# EasyEDA Pro project ProPrj_MEMSdesign_2025-04-10.epro, board PCB2_1
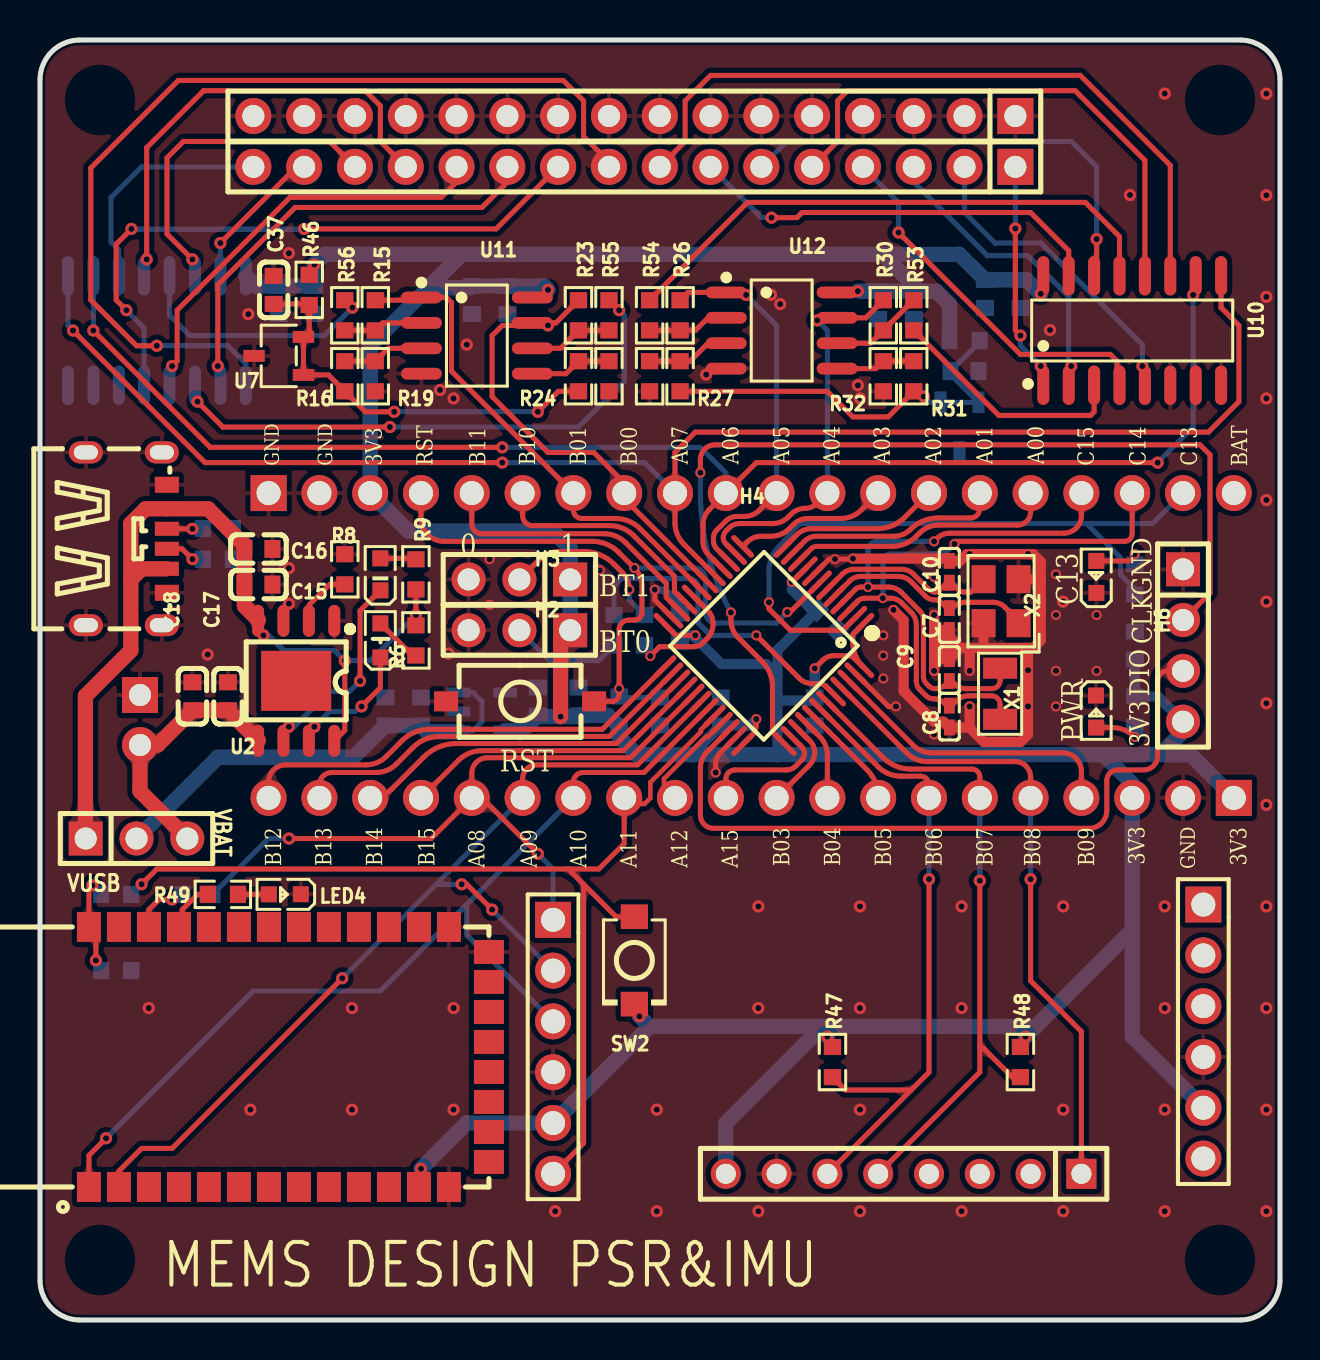
[diagram p4: board, top side]
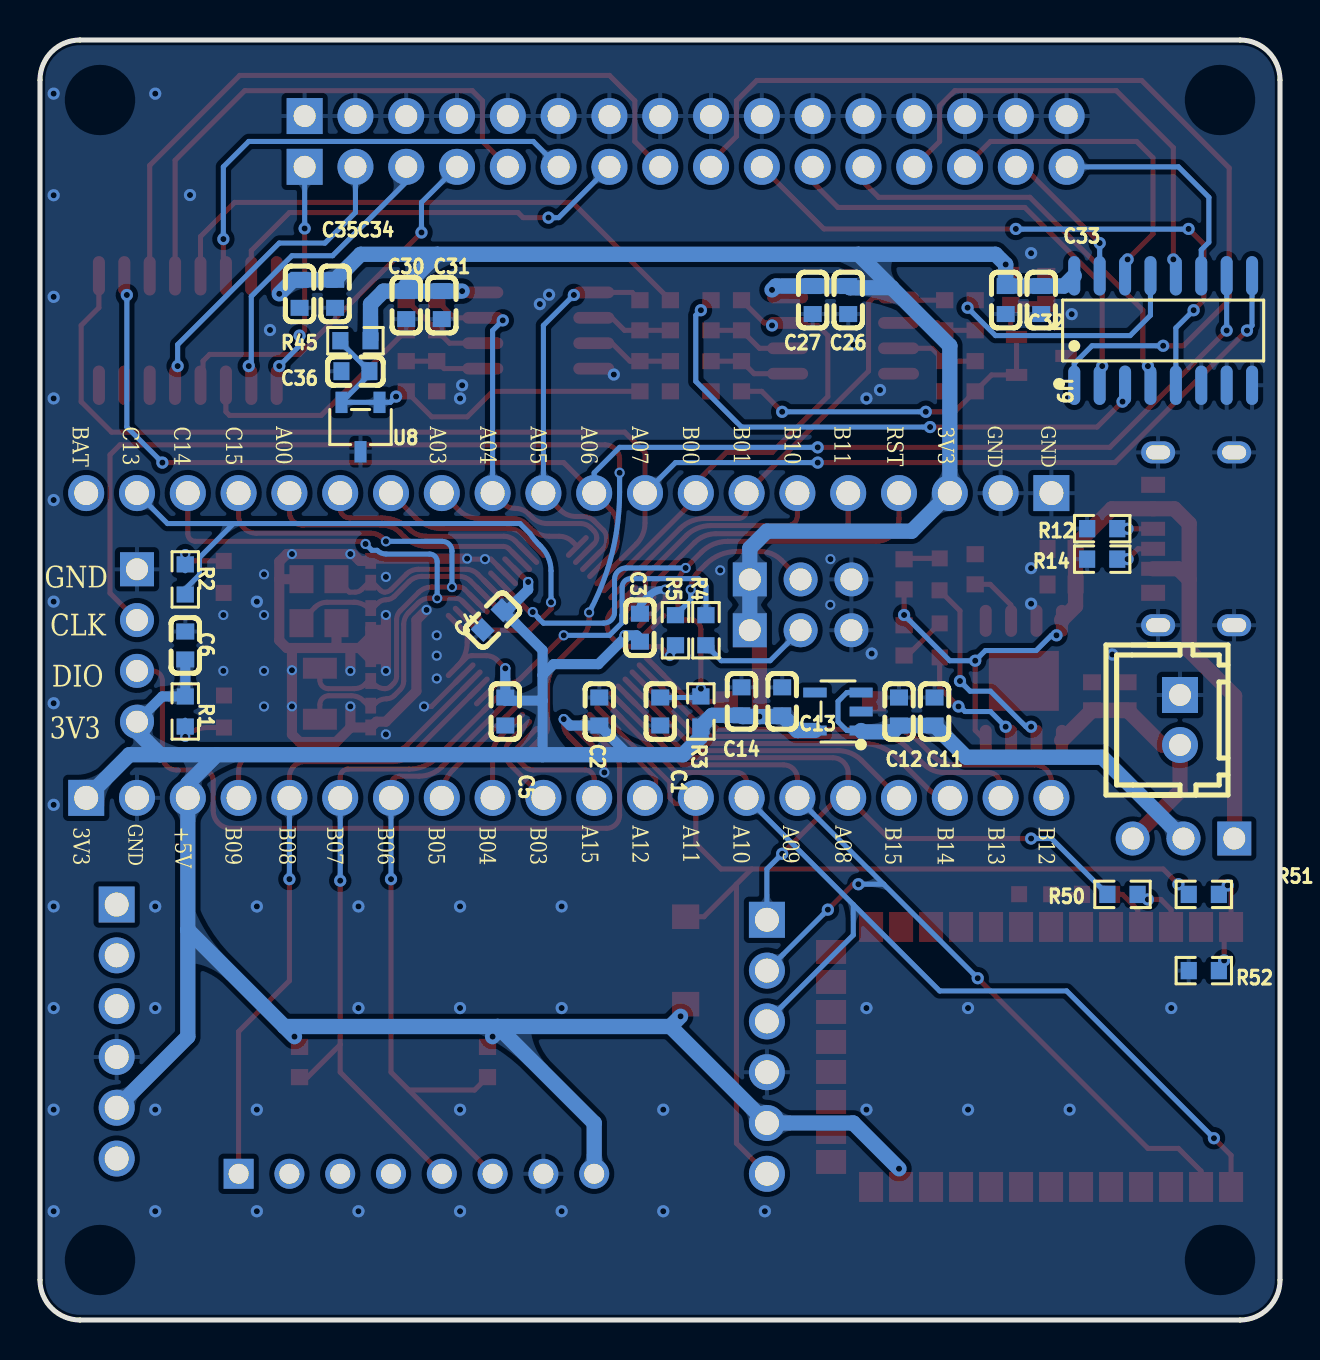
[diagram p5: board, bottom side, seen from below]

Outline 62 x 64 mm; copper layers: Top Layer, Bottom Layer. Coordinates in mm from the lower left corner of the outline.
Outline path: 0,62 arc(0.59,63.41) 2,64 60,64 arc(61.41,63.41) 62,62 62,2 arc(61.41,0.59) 60,0 2,0 arc(0.59,0.59) 0,2 0,62
Stack: Top Layer 0.035mm / Dielectric1 1.51mm FR4 er 4.5 / Bottom Layer 0.035mm

## Design rules (mm)
template: JLCPCB Capability(Two Layers Board)
spacing copperThickness1oz (default): track to track 0.102, other pairs 0.152 to 0.3
spacing copperThickness2oz: track to track 0.203, other pairs 0.152 to 0.3
track width copperThickness1oz (default): min 0.127, default 0.254, max 2.54
track width copperThickness2oz: min 0.203, default 0.254, max 2.54
differential pair differentialPair (default): width min 0.127, default 0.254, max 2.54; gap min 0.152, default 0.152
via viaSize (default): diameter min 0.5, default 0.61, max 10; hole min 0.3, default 0.305, max 6.3

## Placement (name value [footprint] x y rotation side)
C1  100nF  [C0603]  30.99 30.42 90 bottom
C2  100nF  [C0603]  34.04 30.42 270 bottom
C3  100nF  [C0603]  32 34.61 270 bottom
C4  100nF  [C0603]  39.37 35 135 bottom
C5  100nF  [C0603]  38.74 30.42 90 bottom
C6  100nF  [C0603]  54.74 33.73 270 bottom
C7  12pF  [C0402]  45.47 35.05 270 top
C8  12pF  [C0402]  45.47 30.17 90 top
C9  12pF  [C0402]  45.47 32.5 270 top
C10  12pF  [C0402]  45.47 37.41 270 top
C11  1uF  [C0603]  17.27 30.42 270 bottom
C12  100nF  [C0603]  19.05 30.42 270 bottom
C13  100nF  [C0603]  24.89 30.93 270 bottom
C14  1uF  [C0603]  26.92 30.93 270 bottom
C15  100n  [C0603]  10.92 36.77 180 top
C16  10u  [C0603]  10.92 38.55 180 top
C17  10u  [C0603]  9.4 31.19 270 top
C18  100n  [C0603]  7.62 31.19 270 top
C26  10u  [C0603]  21.59 51 270 bottom
C27  100nF  [C0603]  23.37 51 270 bottom
C30  10u  [C0603]  43.69 50.74 270 bottom
C31  100nF  [C0603]  41.91 50.74 270 bottom
C32  10u  [C0603]  13.72 51 270 bottom
C33  100nF  [C0603]  11.94 51 270 bottom
C34  10u  [C0603]  47.24 51.31 270 bottom
C35  100nF  [C0603]  49.02 51.31 270 bottom
C36  100nF  [C0603]  46.23 47.44 180 bottom
C37  100nF  [C0603]  11.68 51.51 270 top
CN1  ZX-XH2.54-2PZZ  [CONN-TH_2P-P2.50_HX25003-2A]  5 30 270 bottom
H1  PZ254V-11-08P  [HDR-TH_8P-P2.54-V-M]  43.18 7.31 180 top
H2  -  [HDR-TH_3P-P2.54-V-M]  23.97 34.49 180 top
H3  -  [HDR-TH_3P-P2.54-V-M]  23.97 37.03 180 top
H4  -  [HDR-TH_20P-P2.54-V-M-1]  35.56 41.35 0 top
H5  -  [HDR-TH_20P-P2.54-V-M-1]  35.56 26.11 180 top
H6  -  [HDR-TH_4P-P2.54-V-M]  57.15 33.73 270 top
H8  PZ254V-11-03P  [HDR-TH_3P-P2.54-V-M]  4.83 24.07 0 top
H10  -  [HDR-TH_6P-P2.54-V-M-1]  25.65 13.66 270 top
H11  HC05  [BULETM-SMD_HC-05]  12.45 13.15 90 top
H12  -  [HDR-TH_6P-P2.54-V-M-1]  58.17 14.42 270 top
H13  HC-PZ254-11.5L-1x16PZ  [HDR-TH_16P-P2.54-V-M]  29.72 60.2 180 top
H14  HC-PZ254-11.5L-1x16PZ  [HDR-TH_16P-P2.54-V-M]  29.72 57.66 180 top
LDO1  ME6211C33M5G-N  [SOT-23-5_L3.0-W1.7-P0.95-LS2.8-BL]  22.1 30.42 90 bottom
LED1  -  [LED_0603]  52.81 30.37 270 top
LED2  -  [LED_0603]  52.81 37.21 90 top
LED3  SZYY0603R  [LED0603-R-RD]  17.02 33.98 90 top
LED4  -  [LED_0603]  12.19 21.28 180 top
R1  1kΩ  [R0603]  54.74 30.42 90 bottom
R2  1kΩ  [R0603]  54.74 37.03 270 bottom
R3  10kΩ  [R0603]  28.96 30.42 270 bottom
R4  10kΩ  [R0603]  28.7 34.49 90 bottom
R5  10kΩ  [R0603]  30.23 34.49 90 bottom
R6  2k  [R0603]  18.8 33.98 270 top
R8  1.2k  [R0603]  15.24 37.54 270 top
R9  10k  [R0603]  18.8 37.28 90 top
R12  5.1kΩ  [R0603]  8.89 39.57 0 bottom
R14  5.1kΩ  [R0603]  8.89 38.04 0 bottom
R15  15k  [R0603]  16.76 50.24 90 top
R16  240k  [R0603]  15.24 47.19 90 top
R19  10K  [R0603]  16.76 47.19 90 top
R23  15k  [R0603]  26.92 50.24 90 top
R24  240k  [R0603]  26.92 47.19 90 top
R25  10K  [R0603]  28.45 47.19 90 top
R26  15k  [R0603]  32 50.24 90 top
R27  240k  [R0603]  32 47.19 90 top
R28  10K  [R0603]  30.48 47.19 90 top
R30  15k  [R0603]  42.16 50.24 90 top
R31  240k  [R0603]  43.69 47.19 90 top
R32  10K  [R0603]  42.16 47.19 90 top
R45  1k  [R0603]  46.23 48.97 180 bottom
R46  1k  [R0603]  13.46 51.51 90 top
R47  4.7k  [R0603]  39.62 12.9 90 top
R48  4.7k  [R0603]  49.02 12.9 90 top
R49  1k  [R0603]  9.14 21.28 0 top
R50  10K  [R0603]  7.87 21.28 0 bottom
R51  10K  [R0603]  3.81 21.28 0 bottom
R52  10K  [R0603]  3.81 17.47 0 bottom
R53  0R  [R0603]  43.69 50.24 90 top
R54  0R  [R0603]  30.48 50.24 270 top
R55  0R  [R0603]  28.45 50.24 270 top
R56  0R  [R0603]  15.24 50.24 270 top
SW1  TS-1101-B-W  [KEY-SMD_2P-L6.0-W3.6-P7.4-LS8.0-L]  24 30.93 0 top
SW2  TS-1088-AR02016  [SW-SMD_L3.9-W3.0-P4.45]  29.72 17.98 270 top
U1  STM32F103C8T6  [LQFP-48_L7.0-W7.0-P0.50-LS9.0-BL]  36.19 33.73 135 top
U2  TP4056-MS  [SOP-8_L4.9-W3.9-P1.27-LS6.0-TL-EP]  12.81 31.96 270 top
U3  XL-1608PGC-06  [LED0603-RD_GREEN]  17.02 37.28 90 top
U7  TL431AIDBZR  [SOT-23-3_L2.9-W1.6-P1.90-LS2.8-BR]  11.94 48.2 0 top
U8  TL431AIDBZR  [SOT-23-3_L2.9-W1.6-P1.90-LS2.8-BR]  45.97 44.65 90 bottom
U9  CD4052BM96  [SOIC-16_L9.9-W3.9-P1.27-LS6.0-BL]  5.84 49.47 180 bottom
U10  CD4052BM96  [SOIC-16_L9.9-W3.9-P1.27-LS6.0-BL]  54.61 49.47 0 top
U11  SGM8552XS8G/TR  [SOIC-8_L4.9-W3.9-P1.27-LS6.0-BL]  21.84 49.22 270 top
U12  SGM8552XS8G/TR  [SOIC-8_L4.9-W3.9-P1.27-LS6.0-BL]  37.08 49.47 270 top
USB1  TYPE-C 6P(073)  [TYPE-C-SMD_TYPE-C-6P_5]  4.32 39.06 270 top
X1  32.768kHz  [OSC-SMD_L3.2-W1.5]  48.01 31.31 90 top
X2  8MHz  [CRYSTAL-SMD_4P-L3.2-W2.5-BL-1]  48.05 35.94 90 top

## Footprints (pads in the part's own frame, mm; a bottom-side part is the same pattern mirrored in y, then rotated)
BULETM-SMD_HC-05
  rect 1.5x1.2 smd: 1(-6.5,10) 2(-6.5,8.5) 3(-6.5,7) 4(-6.5,5.5) 5(-6.5,4) 6(-6.5,2.5) 7(-6.5,1) 8(-6.5,-0.5) 9(-6.5,-2) 10(-6.5,-3.5) 11(-6.5,-5) 12(-6.5,-6.5) 13(-6.5,-8) 22(6.5,-8) 23(6.5,-6.5) 24(6.5,-5) 25(6.5,-3.5) 26(6.5,-2) 27(6.5,-0.5) 28(6.5,1) 29(6.5,2.5) 30(6.5,4) 31(6.5,5.5) 32(6.5,7) 33(6.5,8.5) 34(6.5,10)
  rect 1.2x1.5 smd: 14(-5.25,-10) 15(-3.75,-10) 16(-2.25,-10) 17(-0.75,-10) 18(0.75,-10) 19(2.25,-10) 20(3.75,-10) 21(5.25,-10)
C0402
  rect 0.79x0.54 smd: 1(-0.545,0) 2(0.545,0)
C0603
  rect 0.8x0.9 smd: 1(-0.7,0) 2(0.7,0)
CONN-TH_2P-P2.50_HX25003-2A
  rect 1.8x1.8 hole 1.1: 1(-1.25,0)
  round 1.8 hole 1.1: 2(1.25,0)
CRYSTAL-SMD_4P-L3.2-W2.5-BL-1
  rect 1.4x1.2 smd: 1(-1.1,-0.875) 2(1.1,-0.875) 3(1.1,0.875) 4(-1.1,0.875)
HDR-TH_3P-P2.54-V-M
  rect 1.7x1.7 hole 1.1: 1(-2.54,0)
  round 1.7 hole 1.1: 2(0,0) 3(2.54,0)
HDR-TH_4P-P2.54-V-M
  rect 1.7x1.7 hole 1.1: 1(-3.81,0)
  round 1.7 hole 1.1: 2(-1.27,0) 3(1.27,0) 4(3.81,0)
HDR-TH_6P-P2.54-V-M-1
  rect 1.8x1.8 hole 1.2: 1(-6.35,0)
  round 1.8 hole 1.2: 2(-3.81,0) 3(-1.27,0) 4(1.27,0) 5(3.81,0) 6(6.35,0)
HDR-TH_8P-P2.54-V-M
  rect 1.5x1.5 hole 1: 1(-8.89,0)
  round 1.5 hole 1: 2(-6.35,0) 3(-3.81,0) 4(-1.27,0) 5(1.27,0) 6(3.81,0) 7(6.35,0) 8(8.89,0)
HDR-TH_16P-P2.54-V-M
  rect 1.8x1.8 hole 1.1: 1(-19.05,0)
  round 1.8 hole 1.1: 2(-16.51,0) 3(-13.97,0) 4(-11.43,0) 5(-8.89,0) 6(-6.35,0) 7(-3.81,0) 8(-1.27,0) 9(1.27,0) 10(3.81,0) 11(6.35,0) 12(8.89,0) 13(11.43,0) 14(13.97,0) 15(16.51,0) 16(19.05,0)
HDR-TH_20P-P2.54-V-M-1
  rect 1.8x1.8 hole 1.2: 1(-24.13,0)
  round 1.8 hole 1.2: 2(-21.59,0) 3(-19.05,0) 4(-16.51,0) 5(-13.97,0) 6(-11.43,0) 7(-8.89,0) 8(-6.35,0) 9(-3.81,0) 10(-1.27,0) 11(1.27,0) 12(3.81,0) 13(6.35,0) 14(8.89,0) 15(11.43,0) 16(13.97,0) 17(16.51,0) 18(19.05,0) 19(21.59,0) 20(24.13,0)
KEY-SMD_2P-L6.0-W3.6-P7.4-LS8.0-L
  rect 1.2x1 smd: 1(-3.7,0) 2(3.7,0)
LED0603-R-RD
  rect 0.8x0.8 smd: 1(0.851,0) 2(-0.851,0)
LED0603-RD_GREEN
  rect 0.8x0.8 smd: 1(-0.799,-0.004) 2(0.799,0.004)
LED_0603
  rect 0.8x0.8 smd: 1(-0.851,-0.01) 2(0.75,-0.005)
LQFP-48_L7.0-W7.0-P0.50-LS9.0-BL
  oval 0.27x1.5 smd: 1(-2.75,-4.25) 2(-2.25,-4.25) 3(-1.75,-4.25) 4(-1.25,-4.25) 5(-0.75,-4.25) 6(-0.25,-4.25) 7(0.25,-4.25) 8(0.75,-4.25) 9(1.25,-4.25) 10(1.75,-4.25) 11(2.25,-4.25) 12(2.75,-4.25) 25(2.75,4.25) 26(2.25,4.25) 27(1.75,4.25) 28(1.25,4.25) 29(0.75,4.25) 30(0.25,4.25) 31(-0.25,4.25) 32(-0.75,4.25) 33(-1.25,4.25) 34(-1.75,4.25) 35(-2.25,4.25) 36(-2.75,4.25)
  oval 1.5x0.27 smd: 13(4.25,-2.75) 14(4.25,-2.25) 15(4.25,-1.75) 16(4.25,-1.25) 17(4.25,-0.75) 18(4.25,-0.25) 19(4.25,0.25) 20(4.25,0.75) 21(4.25,1.25) 22(4.25,1.75) 23(4.25,2.25) 24(4.25,2.75) 37(-4.25,2.75) 38(-4.25,2.25) 39(-4.25,1.75) 40(-4.25,1.25) 41(-4.25,0.75) 42(-4.25,0.25) 43(-4.25,-0.25) 44(-4.25,-0.75) 45(-4.25,-1.25) 46(-4.25,-1.75) 47(-4.25,-2.25) 48(-4.25,-2.75)
OSC-SMD_L3.2-W1.5
  rect 1.05x1.7 smd: 1(-1.275,0) 2(1.275,0)
R0603
  rect 0.806x0.864 smd: 1(-0.753,0) 2(0.753,0)
SOIC-8_L4.9-W3.9-P1.27-LS6.0-BL
  oval 0.588x2.045 smd: 1(-1.905,-2.772) 2(-0.635,-2.772) 3(0.635,-2.772) 4(1.905,-2.772) 5(1.905,2.772) 6(0.635,2.772) 7(-0.635,2.772) 8(-1.905,2.772)
SOIC-16_L9.9-W3.9-P1.27-LS6.0-BL
  oval 0.602x1.971 smd: 1(-4.445,-2.736) 2(-3.175,-2.736) 3(-1.905,-2.736) 4(-0.635,-2.736) 5(0.635,-2.736) 6(1.905,-2.736) 7(3.175,-2.736) 8(4.445,-2.736) 9(4.445,2.736) 10(3.175,2.736) 11(1.905,2.736) 12(0.635,2.736) 13(-0.635,2.736) 14(-1.905,2.736) 15(-3.175,2.736) 16(-4.445,2.736)
SOP-8_L4.9-W3.9-P1.27-LS6.0-TL-EP
  oval 1.6x0.6 smd: 1(-3,1.905) 2(-3,0.635) 3(-3,-0.635) 4(-3,-1.905) 5(3,-1.905) 6(3,-0.635) 7(3,0.635) 8(3,1.905)
  rect 3x3.5 smd: 9(0,0)
SOT-23-3_L2.9-W1.6-P1.90-LS2.8-BR
  rect 1.07x0.6 smd: 1(1.235,-0.95) 2(1.235,0.95) 3(-1.235,0)
SOT-23-5_L3.0-W1.7-P0.95-LS2.8-BL
  rect 0.49x1.157 smd: 1(-0.95,-1.153) 2(0,-1.153) 3(0.95,-1.153)
  rect 0.49x1.175 smd: 4(0.95,1.153) 5(-0.95,1.153)
SW-SMD_L3.9-W3.0-P4.45
  rect 1.23x1.36 smd: 1(-2.185,0) 2(2.185,0)
TYPE-C-SMD_TYPE-C-6P_5
  oval 1.1x1.7 hole 0.7x1.2: 7(-4.32,1.775) 7(-4.32,-2.025) 7(4.32,1.775) 7(4.32,-2.025)
  rect 0.7x1.2 smd: A5(-0.5,2.025) A9(1.5,2.025) B5(0.5,2.025) B9(-1.5,2.025)
  rect 0.8x1.2 smd: A12(2.7,2.025) B12(-2.7,2.025)

## Nets
As in the schematic.

Pads without a net: H1 2 3 4; H11 3 4 5 6 7 8 9 10 11 14 15 16 17 18 19 20 23 24 25 26 27 28 29 30 33; H12 1 2 3 6; LDO1 4; U2 9

## Via types
v1: diameter 0.61, hole 0.305, Top Layer to Bottom Layer, 120 vias
v2: diameter 0.508, hole 0.305, Top Layer to Bottom Layer, 47 vias

## Routing (per net, layer and track width the routed paths; a pad name or vN(x,y) marks a point on that pad's centre or on a via; arc(x,y) is an arc through that point)
3V3: length 241.3
  Top Layer w0.254: U1.24 31.8,34.23 v2(32.77,34.23) ; U1.1 40.67,34.32 arc(40.65,34.28) 40.64,34.23 40.64,33.88 arc(40.77,33.22) U1.48 40.72,33.09 arc(40.58,33.18) 40.41,33.22 39.69,33.22 arc(39.39,33.16) 39.15,33 v2(38.74,32.58) ; v2(35.81,30.04) 35.81,29.77 arc(35.76,29.48) 35.59,29.23 U1.36
  Top Layer w0.28: U1.9 37.6,36.9 v2(37.59,36.9)
  Top Layer w0.762: H2.1 26.03,34.01 v1(26.03,30.17)
  Bottom Layer w0.508: 36.87,32.24 36.87,33.49 38.88,35.49 38.62,35.49 37.59,36.52 v2(37.59,36.9) ; 36.87,32.24 36.32,32.79 34.08,32.79 32.77,34.11 v2(32.77,34.23) 32.17,34.23 32,34.07 ; 36.87,32.24 36.87,30.96 ; 36.87,30.96 36.88,30.97 38.74,30.97 v2(38.74,32.58) ; 36.87,30.96 36.87,28.27 ; v2(35.81,30.04) 35.5,29.72 C2.2 32.58,28.27 ; H6.4 55.89,31.18 R1.2 C6.2
  Bottom Layer w0.762: 54.61,19.5 49.78,14.68 ; 54.61,19.5 H5.3 54.61,26.82 53.16,28.27 ; 54.61,19.5 54.61,14.17 H12.5 ; 49.78,14.68 v1(49.28,14.17) ; 49.78,14.68 39.12,14.68 ; 30.48,14.68 39.12,14.68 ; 30.48,14.68 v1(29.97,15.18) ; 30.48,14.68 H10.5 21.34,9.85 v1(19.05,7.56) ; 39.12,14.68 39.12,14.42 v1(39.37,14.17) ; 39.12,14.68 34.29,9.85 H1.8 ; 53.16,28.27 55.99,28.27 ; 53.16,28.27 29.84,28.27 28.96,29.15 R3.2 28.39,30.23 C14.2 26.86,30.17 v1(26.03,30.17) 24.95,30.17 C13.2 24.13,29.47 LDO1.5 ; 19.41,51.61 16.51,48.71 H4.3 18.41,39.44 25.65,39.44 26.51,38.58 H3.1 H2.1 ; 19.41,51.61 21.08,53.28 ; 19.41,51.61 21.5,51.61 C26.1 C27.1 25.21,51.7 v1(25.4,51.51) ; 55.99,28.27 57.15,29.42 H6.4 ; 55.99,28.27 57.53,28.27 H5.1 ; R45.2 45.47,50.79 44.82,51.44 C30.1 ; 42.13,53.28 45.97,53.28 C34.1 C35.1 49.34,52.01 v1(50.04,51.31) ; 42.13,53.28 43.69,51.73 C30.1 ; 42.13,53.28 21.08,53.28 ; C30.1 C31.1 v1(40.89,51.44) ; U9.16 10.8,51.7 C33.1 C32.1 v1(13.72,52.78) 14.22,53.28 21.08,53.28
GND: length 58.4
  Top Layer w0.254: 31.6,35.14 30.74,36 v2(30.74,36.52) ; v2(40.65,38.07) 40.62,38.04 v2(39.75,38.04) 39.45,38.04 U1.8 ; v2(33.78,27.38) 33.78,27.78 arc(33.85,28.1) 34.03,28.38 U1.35 ; v2(42.8,30.68) 42.43,30.68 U1.47
  Top Layer w0.508: C7.2 45.47,34.62 arc(45.41,34.56) 45.37,34.51 ; C7.2 45.37,34.51 ; C7.2 45.47,34.16 ; 44.7,34.45 44.76,34.51 45.37,34.51 ; 44.7,34.45 v2(44.7,35.25) ; 44.7,34.45 44.7,33.05 ; 49.25,33.6 49.4,33.44 v2(49.4,32.49) v2(49.4,30.68) 49.4,29.28 49.02,28.9 47.19,28.9 46.47,29.63 ; 49.25,33.6 49.66,33.6 50.04,33.98 50.04,37.05 ; 49.25,33.6 47.19,33.6 ; 45.37,34.51 arc(45.16,34.13) 45.09,33.7 45.09,33.34 ; 46.47,29.63 C8.1 45.18,29.92 44.71,29.92 43.18,31.44 43.18,35 v2(42.67,35.5) ; 46.47,29.63 46.48,29.64 v2(46.48,30.68) ; 45.47,34.16 C9.1 ; 45.47,34.16 46.03,33.6 ; C9.1 46.03,33.6 ; C9.1 44.72,33.04 44.7,33.05 ; 46.03,33.6 46.49,33.6 ; X2.4 47.18,33.63 arc(47.18,33.61) 47.19,33.6 ; 50.04,37.05 50.04,37.92 49.66,38.3 v2(49.4,38.3) 46.35,38.3 46.01,37.95 C10.1 45.35,38.07 v2(40.65,38.07) ; 50.04,37.05 arc(50.03,37.04) 50.02,37.04 X2.2 ; v2(44.7,32.46) 44.7,33.05 ; 46.49,33.6 46.48,33.59 v2(46.48,32.46) ; 46.49,33.6 47.19,33.6
  Bottom Layer w0.381: 32,35.16 32,35.58 arc(31.97,35.74) 31.88,35.89 31.53,36.23 arc(31.21,36.44) 30.83,36.52 v2(30.74,36.52)
  vias: v1(5.44,15.6) v1(8.38,33.27) v1(10.41,50.29) v1(10.52,10.52) v1(12.45,53.34) v1(12.45,37.59) v1(12.45,35.81) v1(15.6,15.6) v1(15.6,10.52) v1(20,46.5) v1(20.42,33.32) v1(20.68,46.08) v1(20.68,15.6) v1(20.68,10.52) v1(21.34,48.77) v1(25.76,5.44) v1(30.84,10.52) v1(30.84,5.44) v1(33.31,47.27) v1(35.92,20.68) v1(35.92,15.6) v1(35.92,5.44) v1(36.55,51.26) v1(37.01,50.8) v1(40.89,46.74) v1(41,46.08) v1(41,20.68) v1(41,15.6) v1(41,10.52) v1(41,5.44) v1(46.08,20.68) v1(46.08,15.6) v1(46.08,5.44) v1(50.5,49.5) v1(51.16,35.92) v1(51.16,20.68) v1(51.16,10.52) v1(51.16,5.44) v1(54.5,56.25) v1(56.24,61.32) v1(56.24,20.68) v1(56.24,15.6) v1(56.24,10.52) v1(56.24,5.44) v1(61.32,61.32) v1(61.32,56.24) v1(61.32,51.16) v1(61.32,46.08) v1(61.32,41) v1(61.32,35.92) v1(61.32,30.84) v1(61.32,25.76) v1(61.32,20.68) v1(61.32,15.6) v1(61.32,10.52) v1(61.32,5.44) v2(22.48,38.04) v2(22.48,35.76) v2(27.99,37.48) v2(42.16,34.23) v2(42.16,33.22) v2(42.16,32.08) v2(44.7,37.16) v2(44.7,29.28) v2(46.48,38.3) v2(50.8,37.28) v2(50.8,35.25) v2(50.8,32.46) v2(50.8,30.68) v2(52.83,35.25) v2(52.83,32.46)
VIN: length 22.3
  Bottom Layer w0.254: LDO1.3 21.66,31.37 22.1,30.93 22.1,29.92 21.66,29.47 LDO1.1
  Bottom Layer w0.762: LDO1.1 20.88,29.41 19.37,29.41 C12.2 C11.2 15.69,28.14 8.89,28.14 H8.2
ADC1: length 18.6
  Top Layer w0.254: 39.86,50.11 41.28,50.11 R30.2 ; H4.12 38.86,40.84 arc(38.58,40.65) 38.25,40.58 arc(37.88,40.51) 37.56,40.3 37.4,40.14 arc(37.05,39.9) 36.63,39.82 34.97,39.82 arc(34.69,39.77) 34.46,39.61 34.31,39.46 arc(34.2,39.3) 34.16,39.11 arc(34.19,38.95) 34.28,38.82 U1.14
  Bottom Layer w0.254: H4.12 39.37,49.47 v1(38.86,49.98)
ADC2: length 18.5
  Top Layer w0.254: H4.11 35.98,40.5 arc(35.63,40.26) 35.21,40.18 34.84,40.18 arc(34.58,40.13) 34.35,40 arc(34.32,39.97) 34.29,39.95 33.82,39.48 arc(33.71,39.32) 33.68,39.12 33.68,38.94 arc(33.72,38.74) 33.83,38.57 U1.15 ; R26.2 32.39,51.38 U12.1
  Bottom Layer w0.254: v1(35.31,51.25) 36.83,49.73 H4.11
ADC3: length 23.1
  Top Layer w0.254: R23.2 25.79,49.86 U11.7 24.49,49.73 23.11,49.73 22.61,49.22 22.61,46.17 25.4,43.38 27.69,43.38 29.21,41.85 H4.8 arc(29.26,41.09) 29.41,40.87 U1.18
  vias: v1(25.4,49.73)
ADC4: length 24.8
  Top Layer w0.254: R15.2 18.94,50.99 U11.1 20.32,51.12 20.57,50.87 20.57,47.44 H4.7 26.67,40.5 arc(26.79,40.2) 27.09,40.08 28.77,40.08 arc(29.44,39.94) 30,39.57 33.01,36.55
AT: length 53.6
  Top Layer w0.229: U1.32 33.05,29.52 33.05,29.42 30.52,26.89 30.52,26.1 30.23,25.81 29.51,25.81 H5.13
  Top Layer w0.254: 26.42,22.55 27.18,21.79 ; 26.42,22.55 5.84,22.55 v1(5.08,21.79) ; 26.42,22.55 27.94,22.55 29.21,23.82 H5.13 ; 27.18,21.79 28.8,20.16 SW2.1 ; 27.18,21.79 27.18,8.83 H10.6
BAT: length 12.9
  Top Layer w0.762: H8.3 5,26.44 CN1.2 5.88,28.75 C18.2 C17.2 10.9,28.98 U2.5
BLE_RX: length 47.9
  Top Layer w0.254: v1(21.08,21.79) 21.34,21.79 v1(22.61,20.52) ; v1(15.11,17.09) 6.6,8.58 5.08,8.58 3.95,7.45 H11.2 ; 33.01,30.9 29.87,27.76 24.82,27.76 arc(24.33,27.55) 24.13,27.07 H5.15
  Bottom Layer w0.254: H5.15 19.81,21.79 ; 19.81,21.79 v1(21.08,21.79) ; 19.81,21.79 v1(15.11,17.09) ; H10.2 v1(22.61,20.52)
BLE_RX_2: length 11.6
  Top Layer w0.254: U1.21 31.72,36.43 31.72,37.18 29.69,39.21 arc(29.13,39.59) 28.47,39.72 24.63,39.72 arc(24.28,39.87) 24.13,40.22 H4.6
BLE_STATE: length 37.1
  Top Layer w0.254: v1(24.89,23.31) 22.1,26.11 H5.16 ; H5.16 21.59,27.34 arc(21.82,27.89) 22.36,28.11 29.52,28.11 U1.29 ; H5.16 19.56,24.07 v1(12.45,24.07)
  Bottom Layer w0.254: R50.2 11.42,24.07 v1(12.45,24.07) ; v1(24.89,23.31) 25.65,22.55 H10.1
BLE_TX: length 49.9
  Top Layer w0.254: H5.14 26.67,26.89 arc(26.81,27.23) 27.15,27.38 30.2,27.38 U1.31 ; v1(3.3,9.09) 2.45,8.23 H11.1
  Bottom Layer w0.254: 21.34,20.77 17.02,16.45 10.67,16.45 v1(3.3,9.09) ; 21.34,20.77 H5.14 ; 21.34,20.77 21.34,19.25 H10.3
BLE_TX_2: length 14.1
  Top Layer w0.254: H4.5 21.59,39.8 arc(21.73,39.46) 22.08,39.31 28.2,39.31 arc(28.78,39.2) 29.28,38.87 31.31,36.83 31.31,36.13 U1.22
BOOT0: length 16.1
  Top Layer w0.254: v2(35.81,34.23) 37.96,32.09 arc(38.26,31.89) 38.61,31.82 38.96,31.82 arc(39.14,31.78) 39.31,31.68 U1.44
  Bottom Layer w0.254: v2(35.81,34.23) 33.53,34.23 32.91,34.85 32.91,35.23 32.89,35.25 32.89,36.65 arc(32.77,36.94) 32.47,37.07 29.07,37.07 28.7,36.7 R4.2
BOOT1: length 6.4
  Top Layer w0.254: v2(30.51,33.2) 30.98,33.67 32.69,33.67 arc(32.93,33.71) 33.14,33.85 33.34,34.05 arc(33.57,34.4) 33.66,34.82 arc(33.58,35.18) 33.38,35.48 U1.20
  Bottom Layer w0.254: v2(30.51,33.2) 30.23,33.49 R5.1
IMU_INT: length 32.2
  Top Layer w0.254: H5.5 49.53,27.15 arc(49.3,27.69) 48.75,27.92 44.36,27.92 arc(43.81,28.03) 43.35,28.34 U1.45 ; H1.1 52.07,14.42 49.53,16.96 v1(49.53,22.04)
  Bottom Layer w0.254: H5.5 v1(49.53,22.04)
NRST: length 36.2
  Top Layer w0.254: H4.4 19.05,40.08 arc(19.38,39.27) 20.19,38.93 27.61,38.93 arc(28.33,38.79) 28.93,38.39 v2(29.72,37.6) 29.74,37.58 arc(30,37.18) 30.1,36.71 30.1,35.38 arc(29.99,35.11) 29.72,35 29.43,35 arc(29.09,34.86) 28.96,34.52 v2(28.96,31.57) 28.96,31.29 arc(28.85,31.04) 28.6,30.93 27.7,30.93 ; v2(37.36,35.4) 37.51,35.4 U1.7
  Bottom Layer w0.254: R3.1 29.01,31.12 C1.2 ; v2(37.36,35.4) 37.08,35.12 37.08,35.1 36.83,34.84 33.82,34.84 arc(33.43,35) 33.27,35.39 33.27,37.03 arc(33.11,37.43) 32.7,37.6 v2(29.72,37.6)
OSC32_IN: length 30.2
  Top Layer w0.254: U1.3 40.9,35.95 arc(41.05,36.05) 41.23,36.09 v2(42.14,36.09) 42.52,36.09 arc(42.82,36.03) 43.08,35.86 43.57,35.37 arc(43.75,35.1) 43.81,34.78 43.81,31.94 arc(43.86,31.71) 43.99,31.52 44.29,31.22 arc(44.47,31.1) 44.68,31.06 arc(44.99,31) 45.25,30.82 45.47,30.61 45.82,30.96 arc(46.1,31.15) 46.43,31.21 47.57,31.21 arc(47.88,31.08) 48.01,30.77 X1.1 ; H4.18 54.61,39.31 arc(54.5,39.04) 54.23,38.93 45.77,38.93 arc(45.72,38.88) v2(45.72,38.8)
  Bottom Layer w0.254: v2(45.72,38.8) 45.41,38.48 45.14,38.48 arc(44.94,38.35) 44.69,38.3 42.52,38.3 arc(42.25,38.19) 42.14,37.92 v2(42.14,36.09)
OSC32_OUT: length 27.9
  Top Layer w0.254: X1.2 48.01,31.99 arc(47.88,31.69) 47.59,31.57 46.29,31.57 arc(45.99,31.63) 45.73,31.8 45.47,32.06 arc(45.19,31.7) 44.75,31.57 arc(44.59,31.6) 44.45,31.69 44.32,31.83 arc(44.21,31.99) 44.17,32.18 44.17,35.02 arc(44.12,35.26) 43.99,35.45 43.07,36.37 arc(42.77,36.58) 42.41,36.65 v2(41.4,36.65) 41.04,36.65 arc(40.9,36.62) 40.77,36.53 U1.4 40.1,35.85 ; v2(44.7,38.93) 44.85,39.08 arc(45.14,39.27) 45.47,39.34 51.18,39.34 arc(51.81,39.6) 52.07,40.23 H4.17
  Bottom Layer w0.254: v2(41.4,36.65) 41.4,38.45 arc(41.54,38.79) 41.89,38.93 v2(44.7,38.93)
OSC_IN: length 10.9
  Top Layer w0.254: X2.1 48.93,34.96 48.25,35.64 arc(47.97,35.82) 47.65,35.89 46.31,35.89 ; U1.5 40.48,36.95 arc(40.73,37.12) 41.03,37.18 42.9,37.18 arc(43.26,37.11) 43.56,36.91 44.28,36.19 arc(44.47,36.06) 44.7,36.01 arc(44.92,35.97) 45.11,35.84 45.47,35.48 45.55,35.57 arc(45.9,35.8) 46.31,35.89 ; 46.16,35.89 46.31,35.89
OSC_OUT: length 9.3
  Top Layer w0.254: U1.6 40.11,37.29 arc(40.39,37.47) 40.71,37.54 43.09,37.54 arc(43.41,37.47) 43.68,37.29 44.44,36.53 arc(44.59,36.43) 44.77,36.39 arc(44.87,36.41) 44.97,36.48 45.47,36.98 45.91,36.53 arc(46.06,36.43) 46.24,36.39 46.53,36.39 X2.3
PA0: length 13.5
  Top Layer w0.254: H4.16 49.53,40.4 arc(49.34,39.94) 48.87,39.75 44.93,39.75 arc(44.42,39.64) 43.98,39.35 43.81,39.18 arc(43.25,38.81) 42.6,38.68 38.84,38.68 arc(38.69,38.65) 38.56,38.56 U1.10
PA1: length 11
  Top Layer w0.254: H4.15 46.99,40.57 arc(46.85,40.24) 46.52,40.1 44.91,40.1 arc(44.16,39.95) 43.52,39.53 arc(43.14,39.28) 42.7,39.19 38.81,39.19 arc(38.5,39.12) 38.24,38.95 37.61,38.32
PA2: length 8.2
  Top Layer w0.254: H4.14 43.24,40.14 arc(42.61,39.72) 41.87,39.57 38.58,39.57 arc(38.18,39.49) 37.84,39.26 U1.12
PA3: length 7.7
  Top Layer w0.254: H4.13 41.06,40.49 arc(40.6,40.18) 40.05,40.08 38.39,40.08 arc(38.01,40) 37.68,39.78 37.47,39.57 arc(37.04,39.29) 36.54,39.19 36.05,39.19 arc(35.68,39.11) 35.36,38.9 U1.13
PA6: length 74.2
  Top Layer w0.254: v1(23.11,43.63) 8.51,43.63 v1(2.67,49.47) ; v1(55.88,42.87) 35.81,42.87 H4.10 33.47,40.53 arc(33.23,40.17) 33.15,39.74 33.15,38.92 arc(33.22,38.57) 33.42,38.27 U1.16
  Bottom Layer w0.254: v1(55.88,42.87) 57.66,44.65 v1(57.66,51.25) ; H4.10 34.29,42.36 33.02,43.63 v1(23.11,43.63) ; U9.10 v1(2.67,49.47)
PA7: length 79.1
  Top Layer w0.254: U10.9 59.06,50.62 59.94,49.73 59.94,45.92 58.42,44.39 32.77,44.39 31.75,43.38 H4.9 31.75,39.85 arc(31.86,39.28) 32.19,38.8 U1.17 ; v1(1.65,49.47) 8.25,42.87 v1(23.11,42.87)
  Bottom Layer w0.254: v1(23.11,42.87) 30.23,42.87 H4.9 ; U9.9 1.4,49.73 v1(1.65,49.47)
PA12: length 5.2
  Top Layer w0.229: U1.33 33.39,29.16 33.29,29.16 31.2,27.07 31.2,26.64 31.74,26.11 H5.12
PA13/SWDIO: length 36
  Top Layer w0.254: U1.34 33.35,28.41 arc(33.11,28.04) 33.02,27.6 33.02,25.24 arc(33.21,24.78) 33.68,24.58 52.45,24.58 arc(53.08,24.84) 53.34,25.47 53.34,26.97 arc(53.49,27.35) 53.87,27.5 55.19,27.5 arc(55.68,27.71) 55.88,28.2 55.88,31.95 arc(56.03,32.31) 56.38,32.46 H6.3
PA14/SWCLK: length 50.4
  Top Layer w0.254: v2(33.02,42.36) 33.02,43.03 arc(33.23,43.55) 33.74,43.76 58,43.76 58.5,43.26 58.5,36.35 H6.2 ; v2(34.54,35.38) 34.54,35 arc(34.64,34.53) 34.9,34.13 36.12,32.92 arc(36.39,32.56) 36.56,32.15 arc(36.59,32.04) 36.61,31.93 arc(36.62,31.81) 36.62,31.69 36.62,29.59 arc(36.66,29.42) 36.75,29.28 U1.37
  Bottom Layer w0.254: v2(33.02,42.36) 33.02,41.4 arc(33.06,40.39) 33.18,39.38 arc(33.69,37.32) v2(34.54,35.38)
PA15: length 6.6
  Top Layer w0.254: 37.61,29.13 38.1,28.63 arc(38.2,28.5) 38.23,28.34 arc(38.19,28.15) 38.09,28 37.78,27.69 arc(37.57,27.55) 37.33,27.5 34.75,27.5 arc(34.43,27.37) 34.29,27.04 H5.11
PB3: length 4.4
  Top Layer w0.254: U1.39 38.51,28.94 arc(38.68,28.69) 38.74,28.39 arc(38.67,28.04) 38.47,27.74 H5.10
PB4: length 4.1
  Top Layer w0.254: H5.9 39.37,28.26 arc(39.27,28.74) 39,29.15 U1.40
PB5: length 5.3
  Top Layer w0.254: H5.8 41.91,26.16 arc(41.76,26.89) 41.35,27.51 U1.41
PB6: length 32.7
  Top Layer w0.254: 43.56,11.5 44.45,12.39 v1(44.45,22.04) ; 43.56,11.5 H1.6 ; 43.56,11.5 40.27,11.5 R47.1 ; U1.42 41.9,27.67 arc(42.43,27.31) 43.05,27.19 44.02,27.19 arc(44.32,27.06) 44.45,26.76 H5.7
  Bottom Layer w0.254: H5.7 v1(44.45,22.04)
PB7: length 33.8
  Top Layer w0.254: R48.1 48.62,12.14 46.99,13.77 ; H5.6 46.99,27.15 arc(46.87,27.43) 46.6,27.55 43.54,27.55 arc(42.79,27.7) 42.15,28.12 U1.43 ; 46.99,13.77 v1(46.99,21.97) ; 46.99,13.77 46.99,12.39 H1.5
  Bottom Layer w0.254: H5.6 v1(46.99,21.97)
PB9: length 14.9
  Top Layer w0.254: H5.4 52.07,27.43 arc(51.8,28.08) 51.14,28.35 44.61,28.35 arc(44.09,28.46) 43.64,28.76 U1.46
PB12: length 23
  Top Layer w0.254: U1.25 28.12,29.53 19.47,29.53 arc(18.73,29.39) 18.1,28.97 17.31,28.17 arc(16.85,27.87) 16.3,27.76 12.28,27.76 arc(11.68,27.51) 11.43,26.9 H5.20
PB13: length 20.5
  Top Layer w0.254: H5.19 13.97,26.76 arc(14.15,27.2) 14.58,27.38 16.8,27.38 arc(17.35,27.49) 17.82,27.8 18.66,28.63 arc(19.26,29.04) 19.97,29.18 28.47,29.18 31.6,32.31
PB14: length 17.7
  Top Layer w0.254: U1.27 28.82,28.82 20.82,28.82 arc(19.94,28.65) 19.18,28.14 17.59,26.56 arc(17.1,26.22) H5.18
PB15: length 15.5
  Top Layer w0.254: U1.28 29.17,28.47 22.1,28.47 arc(21.46,28.34) 20.93,27.98 H5.17
PC13: length 34.2
  Top Layer w0.254: U1.2 40.23,34.58 arc(40.13,34.51) 40.01,34.49 37.52,34.49 36.45,35.56 v2(36.45,35.89)
  Bottom Layer w0.254: H4.19 55.63,39.82 52.32,39.82 ; 52.32,39.82 38,39.82 37.49,39.31 arc(37.29,39.03) 37.05,38.77 36.96,38.68 arc(36.58,38.12) 36.45,37.45 v2(36.45,35.89) ; 52.32,39.82 54.03,38.12 54.03,37.26 54.74,36.55 R2.2
R_CHANNEL_1: length 12.2
  Top Layer w0.254: R53.1 47.94,45.23 52.53,45.23 52.71,45.41 U10.3
R_CHANNEL_2: length 28.2
  Top Layer w0.254: R54.1 35.37,55.88 52.27,55.88 53.97,54.17 U10.13
R_CHANNEL_3: length 26.5
  Top Layer w0.254: v1(7.87,45.92) 9.14,44.65 v1(17.5,44.65)
  Bottom Layer w0.254: v1(17.5,44.65) 26.92,44.65 29.21,46.93 29.21,50.24 v1(28.96,50.49)
R_CHANNEL_4: length 12.1
  Bottom Layer w0.254: U9.13 6.48,50.24 7.49,49.22 14.22,49.22 v1(15.62,50.62)
RIN_1: length 10.5
  Top Layer w0.254: v1(48.77,54.58) 48.77,49.47 v1(49.02,49.22)
  Bottom Layer w0.254: v1(49.02,49.22) 49.02,48.71 v1(50.04,47.7) ; v1(48.77,54.58) H14.1
RIN_2: length 15
  Bottom Layer w0.254: H14.2 46.23,55.37 47.75,53.85 50.04,53.85 55.12,48.77 v1(55.12,47.7)
RIN_3: length 14.5
  Bottom Layer w0.254: v1(51.56,47.7) 51.44,47.82 51.44,51.18 49.4,53.21 47.37,53.21 43.56,57.02 43.56,57.53 H14.3
RIN_4: length 18.9
  Top Layer w0.254: U10.4 53.85,46.87 53.85,47.95 53.52,48.28 49.02,48.28 v1(42.93,54.38)
  Bottom Layer w0.254: H14.4 42.93,55.88 v1(42.93,54.38)
RIN_5: length 26.6
  Top Layer w0.254: U10.12 55.25,57.98 51.76,61.47 40.39,61.47 39.88,60.96 39.88,58.93 H14.5
RIN_6: length 23.3
  Top Layer w0.254: v1(52.83,54.05) 52.83,52.34 U10.14
  Bottom Layer w0.254: H14.6 37.34,58.93 51.56,58.93 52.83,57.66 v1(52.83,54.05)
RIN_7: length 21.1
  Top Layer w0.254: v1(36.58,55.12) 37.85,55.12 38.1,55.37 49.53,55.37 51.44,53.47 U10.15
  Bottom Layer w0.254: H14.7 36.07,55.12 v1(36.58,55.12)
RIN_8: length 36
  Top Layer w0.254: H14.8 32.26,58.93 32.26,60.96 33.53,62.23 52.01,62.23 56.51,57.73 U10.11
RIN_9: length 47.4
  Top Layer w0.254: H14.9 28.45,57.91 27.18,59.18 27.18,60.96 26.16,61.98 6.91,61.98 2.54,57.6 2.54,51 4.83,48.71 v1(5.84,48.71)
  Bottom Layer w0.254: v1(5.84,48.71) 9.4,48.71 10.29,47.82 U9.1
RIN_10: length 31.3
  Top Layer w0.254: v1(4.57,54.55) 3.81,53.79 3.81,51 v1(4.32,50.49) ; H14.10 22.8,54.55 v1(13.21,54.55)
  Bottom Layer w0.254: v1(4.32,50.49) 5.21,49.6 U9.5 ; v1(4.57,54.55) 4.58,54.54 13.2,54.54 v1(13.21,54.55)
RIN_11: length 21.4
  Top Layer w0.254: H14.11 23.37,56.9 22.1,55.63 12.76,55.63 8.89,51.76 v1(8.89,47.7)
RIN_12: length 20.3
  Top Layer w0.254: H14.12 20.83,56.9 20.07,56.13 12.5,56.13 6.86,50.49 6.86,47.95 v1(6.6,47.7)
RIN_13: length 22.3
  Top Layer w0.254: H14.13 17.02,58.93 17.02,60.71 16.26,61.47 8.18,61.47 5.33,58.62 v1(5.33,53.03)
RIN_14: length 15.9
  Top Layer w0.254: v1(7.62,53.03) 6.35,54.3 6.35,58.11 7.17,58.93 14.48,58.93 H14.14
RIN_15: length 7.4
  Top Layer w0.254: v1(9.02,53.85) 12.83,57.66 H14.15
  Bottom Layer w0.254: U9.15 v1(9.02,53.85)
RIN_16: length 11.8
  Bottom Layer w0.254: H14.16 5.08,57.66 3.56,56.13 3.56,53.89 3.94,53.51 U9.11
VREF_1: length 19.9
  Top Layer w0.254: R31.1 42.41,45.16 40.64,45.16 39.36,46.43 R27.1
  Bottom Layer w0.254: v1(44.2,46.17) 44.49,45.88 U8.1 U8.2 45.53,47.28 C36.2 46.98,48.9 R45.1
VREF_2: length 20.4
  Top Layer w0.254: C37.2 13.41,50.81 R46.1 13.46,49.44 U7.2 U7.1 14.42,47.25 R16.1 16.26,45.41 v1(17.71,45.41) ; R24.1 25.92,46.43 v1(24.89,45.41)
  Bottom Layer w0.254: v1(17.71,45.41) v1(24.89,45.41)
VUSB: length 44.1
  Top Layer w0.254: v1(18.8,35.25) R9.1 ; v1(15.24,32.96) 15.24,29.48 U2.8
  Top Layer w0.762: 4.54,37.02 4.54,33.47 2.27,31.2 2.27,24.09 H8.1 ; 4.54,37.02 4.54,39.82 5.28,40.56 USB1.B9 8.41,40.56 10.22,38.74 C16.2 C15.2 10.22,35.7 10.9,35.01 U2.4 ; 4.54,37.02 5.08,37.56 USB1.A9
  Bottom Layer w0.254: v1(18.8,35.25) 16.51,32.96 v1(15.24,32.96) 14.73,33.47 12.19,33.47 11.43,34.23 v1(11.18,34.23)
$1N2074: length 2.9
  Top Layer w0.254: LED1.2 53.6,29.62 arc(54.22,29.5) v2(54.74,29.15)
  Bottom Layer w0.254: 54.74,29.99 v2(54.74,29.15)
$1N2077: length 3
  Top Layer w0.254: LED2.2 54.39,37.95 arc(54.64,38.06) v2(54.74,38.3)
  Bottom Layer w0.254: 54.74,37.46 v2(54.74,38.3)
$1N3296: length 8.5
  Top Layer w0.254: H3.2 24.93,37.99 arc(25.41,38.31) 25.98,38.42 27.17,38.42 arc(28,38.26) 28.7,37.79 29.1,37.39 arc(29.37,36.99) v2(29.46,36.52)
  Bottom Layer w0.254: v2(29.46,36.52) 29.46,36 R5.2
$1N11047: length 5.7
  Bottom Layer w0.254: H2.2 25.49,32.96 27.93,32.96 R4.1
$2N370: length 3
  Top Layer w0.254: R8.2 14.49,36.78 13.46,35.76 13.46,34.98 U2.2
$2N655: length 9.5
  Top Layer w0.254: U3.1 16,35.46 v1(16,31.95)
  Bottom Layer w0.254: v1(12.45,29.66) 12.7,29.66 14.48,31.44 15.49,31.44 v1(16,31.95)
$2N660: length 1.8
  Top Layer w0.254: R9.2 18.75,38.08 U3.2
$2N665: length 5.6
  Top Layer w0.254: v1(16.08,30.68) 17.02,31.62 LED3.2
  Bottom Layer w0.254: v1(13.72,29.66) 14.48,30.42 15.75,30.42 16,30.68 v1(16.08,30.68)
$2N669: length 2.4
  Top Layer w0.254: R6.2 18.62,33.23 LED3.1
$2N1135: length 1.3
  Top Layer w0.254: USB1.A5 v1(7.62,39.56)
$2N1136: length 1.5
  Top Layer w0.254: v1(7.62,38.04) 7.1,38.56 USB1.B5
$3N3484: length 4
  Top Layer w0.254: U12.5 41.79,47.57 R32.2 R31.2
$3N3577: length 4.3
  Top Layer w0.254: R28.2 R27.2 32.5,47.94 33.53,48.97 34.18,48.97 U12.3
$3N3823: length 4.1
  Top Layer w0.254: U11.5 26.3,47.31 R24.2 R25.2
$3N3894: length 4.1
  Top Layer w0.254: R16.2 R19.2 17.41,48.58 U11.3
$3N14374: length 4.7
  Top Layer w0.254: R53.2 43.67,50.99 R30.1 41.52,48.84 U12.6
$3N14434: length 4.1
  Top Layer w0.254: R54.2 R26.1 32.77,49.48 33.4,50.11 34.31,50.11
$3N14466: length 4.2
  Top Layer w0.254: R55.2 R23.1 26.03,48.58 U11.6
$3N14499: length 4
  Top Layer w0.254: U11.2 17.14,49.86 R15.1 R56.2
$6N516: length 1.5
  Top Layer w0.254: LED4.2 11.44,21.28 R49.2
$6N537: length 2.5
  Top Layer w0.254: H11.31 7.11,19.82 7.11,20.52 7.87,21.28 R49.1
$6N542: length 2.2
  Top Layer w0.254: v1(6.6,21.03) 5.95,21.03 5.45,20.52 H11.32
$6N596: length 4
  Top Layer w0.254: v1(2.79,17.98) 2.79,19.3 H11.34 2.45,21.56 v1(2.61,21.73)

## Copper pours and planes (outline as drawn; the poured copper is in the pictures)
GND on Top Layer: 0,64 62,64 62,0 0,0
GND on Bottom Layer: 0,64.01 61.98,64.01 61.98,0 0,0

Small or netless copper shapes (teardrops, artwork), in the pictures only: 248 on Top Layer, 167 on Bottom Layer

## Text on the board
Bottom Silkscreen Layer: GND | 3V3 | RST | B11 | B10 | B01 | B00 | A07 | A06 | A05 | A04 | A03 | A00 | C15 | C14 | C13 | BAT | B12 | B13 | B14 | B15 | A08 | A09 | A10 | A11 | A12 | A15 | B03 | B04 | B05 | B06 | B07 | B08 | B09 | +5V | DIO | CLK
Top Silkscreen Layer: VUSB | VBAT | MEMS DESIGN PSR&IMU | GND | B12 | B13 | 3V3 | B14 | RST | B15 | A08 | B11 | B10 | A09 | B01 | A10 | A11 | B00 | A12 | A07 | A15 | A06 | A05 | B03 | A04 | B04 | A03 | B05 | A02 | B06 | A01 | B07 | B08 | A00 | C15 | B09 | C14 | C13 | BAT | DIO | CLK | PWR | 0 | 1 | BT1 | BT0
